# EAGLE design wireless breakout (EAGLE 6.5.0)
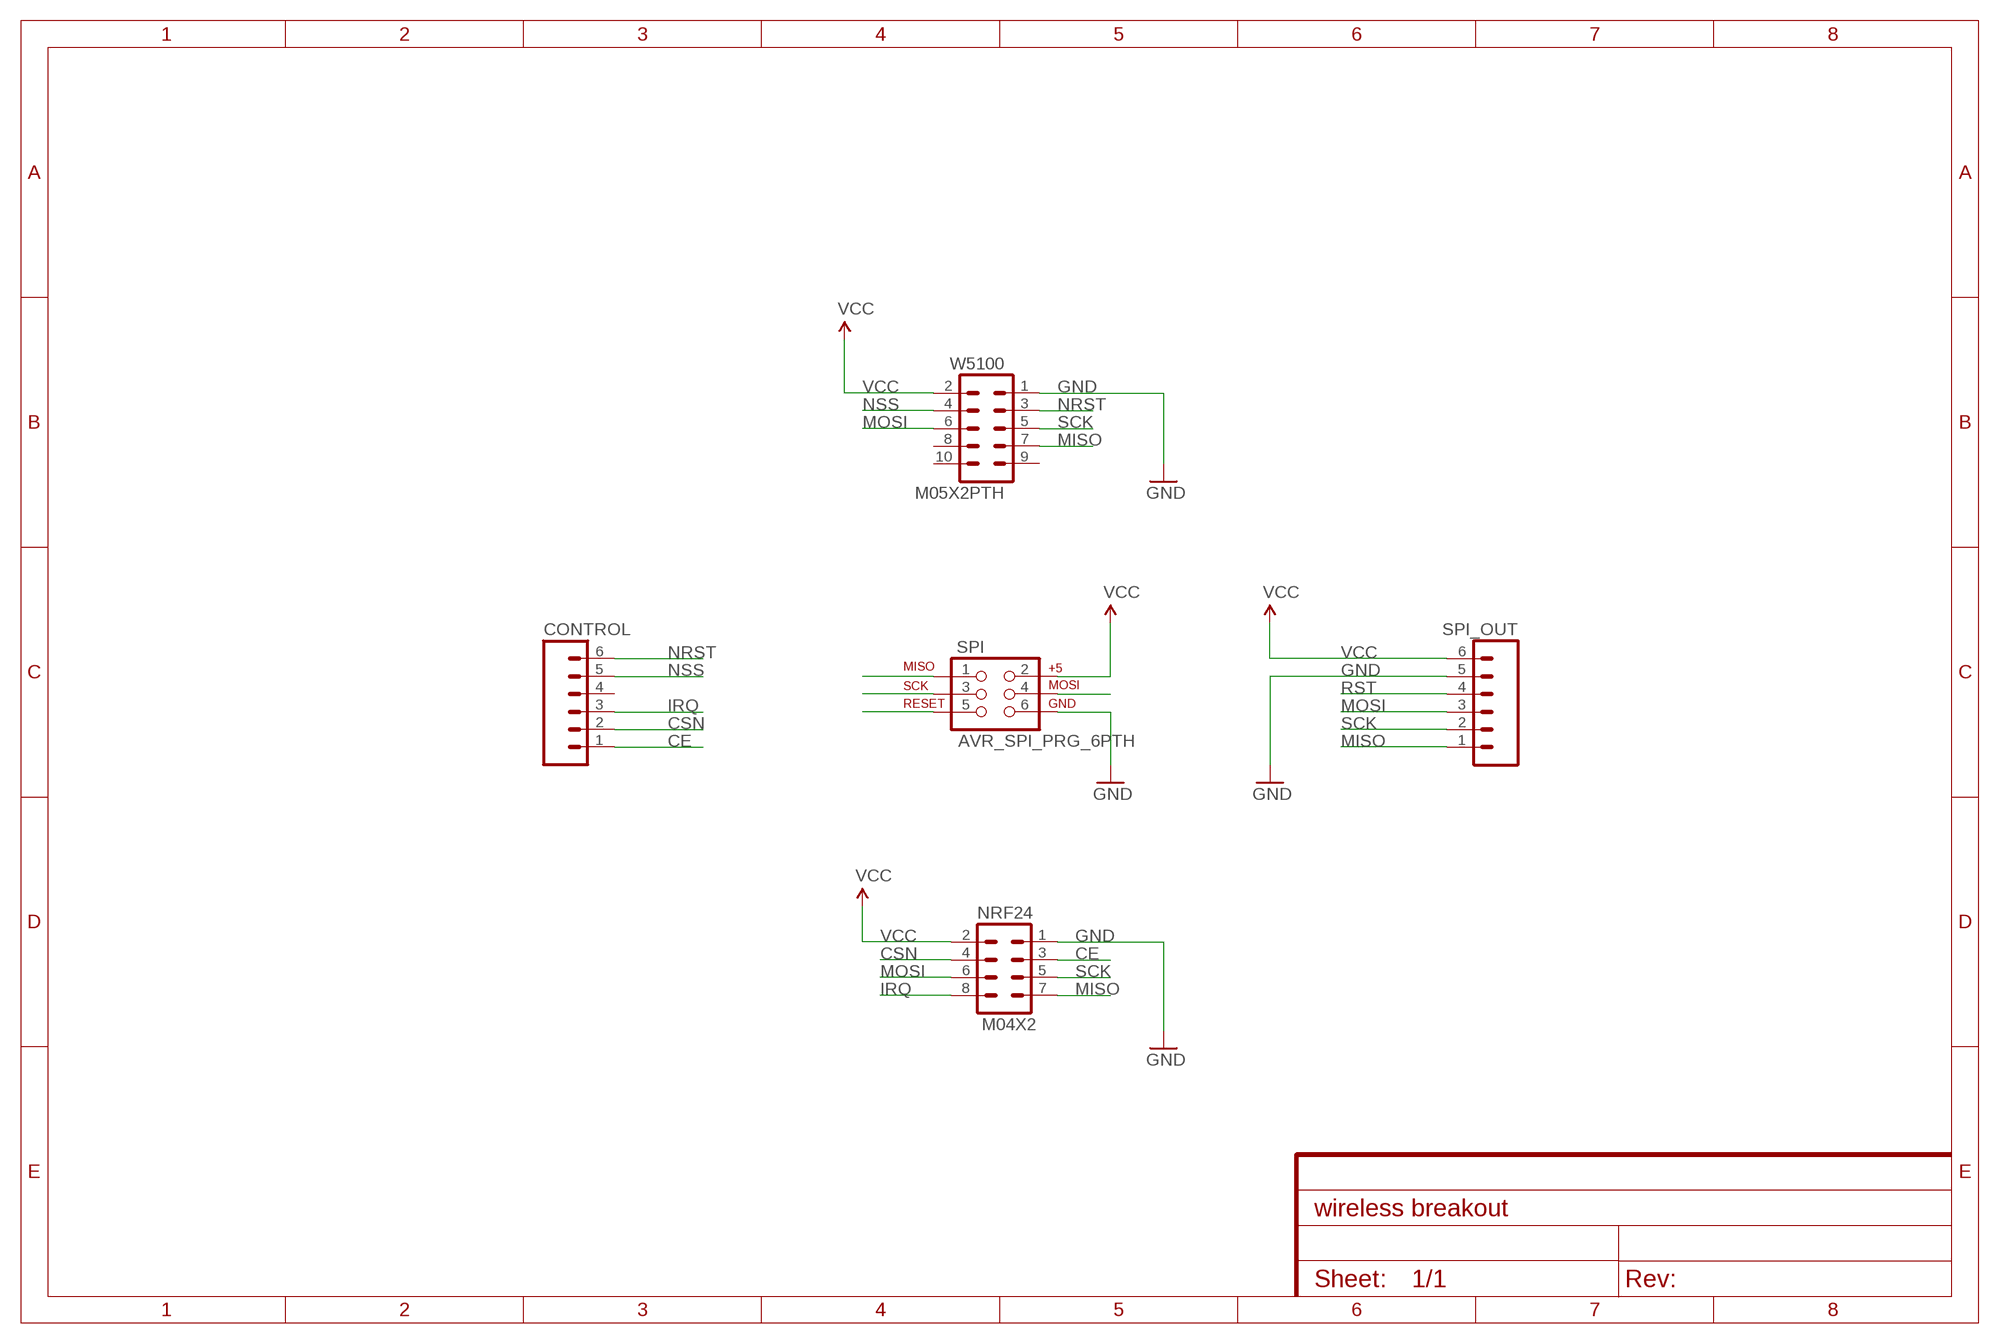
[diagram p0: schematic, sheet 1]

## Parts
CONTROL  M06LOCK  [1X06_LOCK]
NRF24  M04X2  [2X4]
SPI  AVR_SPI_PRG_6PTH  [2X3]
SPI_OUT  M06LOCK  [1X06_LOCK]
W5100  M05X2PTH  [AVR_ICSP]

## Nets
CE: CONTROL.1 NRF24.3
CSN: CONTROL.2 NRF24.4
GND: NRF24.1 SPI.6 SPI_OUT.5 W5100.1
IRQ: CONTROL.3 NRF24.8
MISO: NRF24.7 SPI.1 SPI_OUT.1 W5100.7
MOSI: NRF24.6 SPI.4 SPI_OUT.3 W5100.6
NRST: CONTROL.6 W5100.3
NSS: CONTROL.5 W5100.4
RST: SPI.5 SPI_OUT.4
SCK: NRF24.5 SPI.3 SPI_OUT.2 W5100.5
VCC: NRF24.2 SPI.2 SPI_OUT.6 W5100.2
Unconnected: CONTROL.4 W5100.8 W5100.9 W5100.10

## Library data of the parts
CONTROL SPI_OUT = SparkFun-Connectors:M06: Header 6 Standard 6-pin 0.1" header. Use with straight break away headers (SKU : PRT-00116), right angle break away headers (PRT-00553), swiss pins (PRT-00743), machine pins (PRT-00117), and female headers (PRT-00115). Molex polarized connector foot print use with SKU : PRT-08094 with associated crimp pins and housings. NOTES ON THE VARIANTS LOCK and LOCK_LONGPADS... This footprint was designed to help hold the alignment of a through-hole component (i.e. 6-pin header) while soldering it into place. You may notice that each hole has been shifted either up or down by 0.005 of an inch from it's more standard position (which is a perfectly straight line). This slight alteration caused the pins (the squares in the middle) to touch the edges of the holes. Because they are alternating, it causes a "brace" to hold the component in place. 0.005 has proven to be the perfect amount of "off-center" position when using our standard breakaway headers. Although looks a little odd when you look at the bare footprint, once you have a header in there, the alteration is very hard to notice. Also,if you push a header all the way into place, it is covered up entirely on the bottom side. This idea of altering the position of holes to aid alignment will be further integrated into the Sparkfun Library for other footprints. It can help hold any component with 3 or more connection pins.
NRF24 = SparkFun-Connectors:M04X2: .1" header, two rows of four.
SPI = SparkFun-Connectors:AVR_SPI_PRG_6: AVR ISP 6 Pin This is the reduced ISP connector for AVR programming. Common on Arduino. This footprint will take up less PCB space and can be used with a 10-pin to 6-pin adapter such as SKU: BOB-08508
W5100 = SparkFun-Connectors:M05X2: Header 5x2 Standard 10-pin dual row 0.1" header. Commonly used with AVR-ISP. Use with Spark Fun Electronics SKU: PRT-00778

## Board
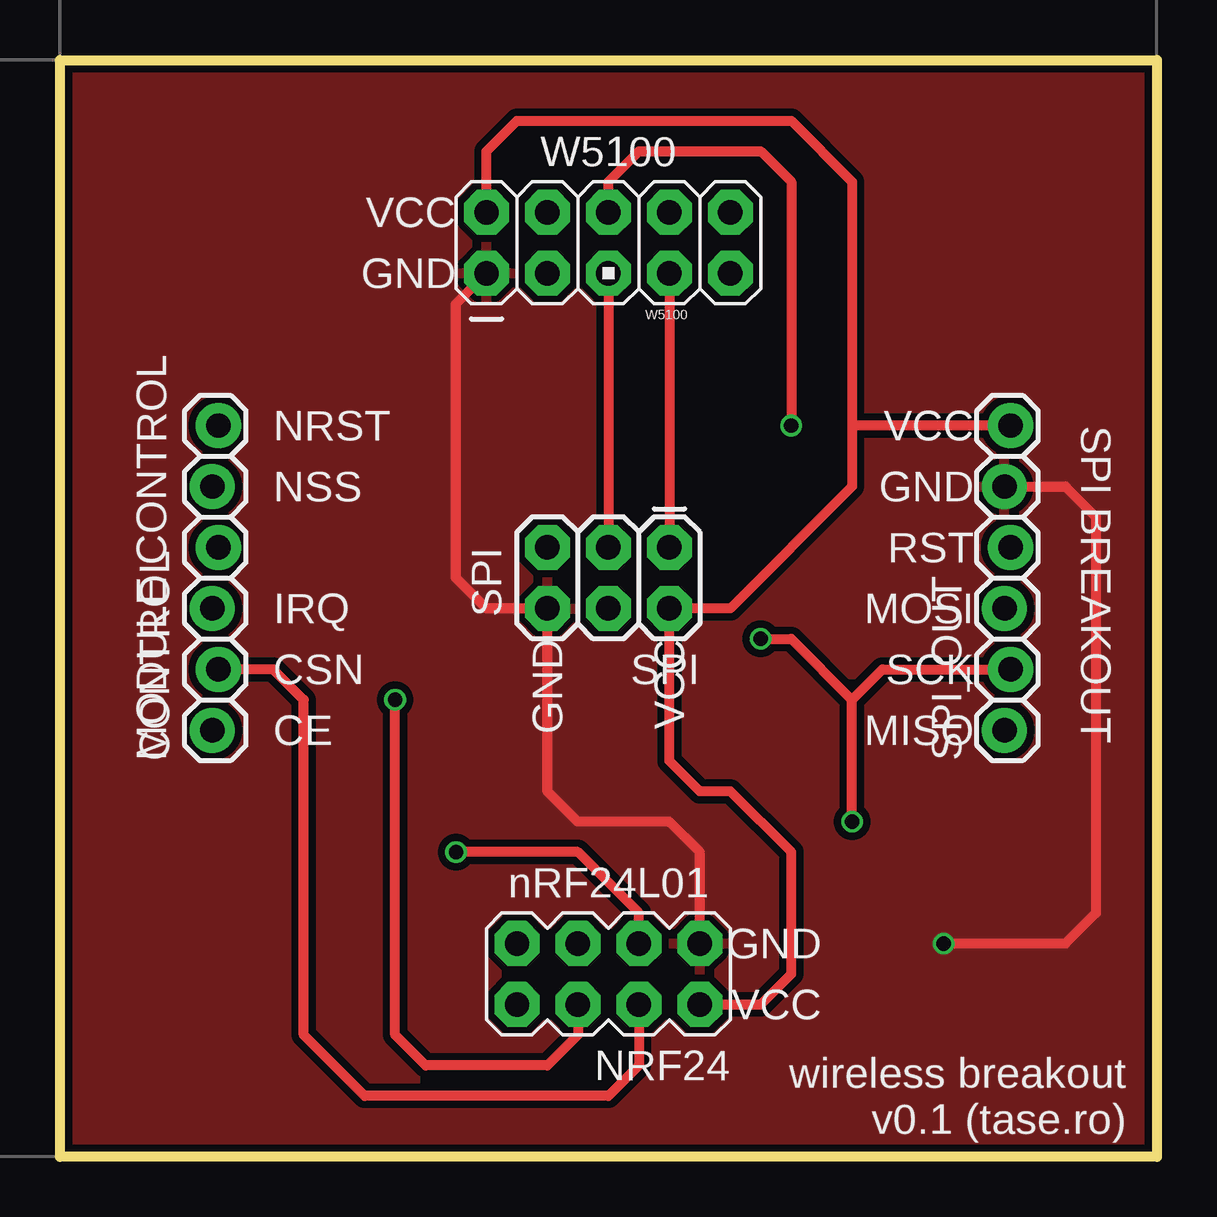
[diagram p1: board, top side]
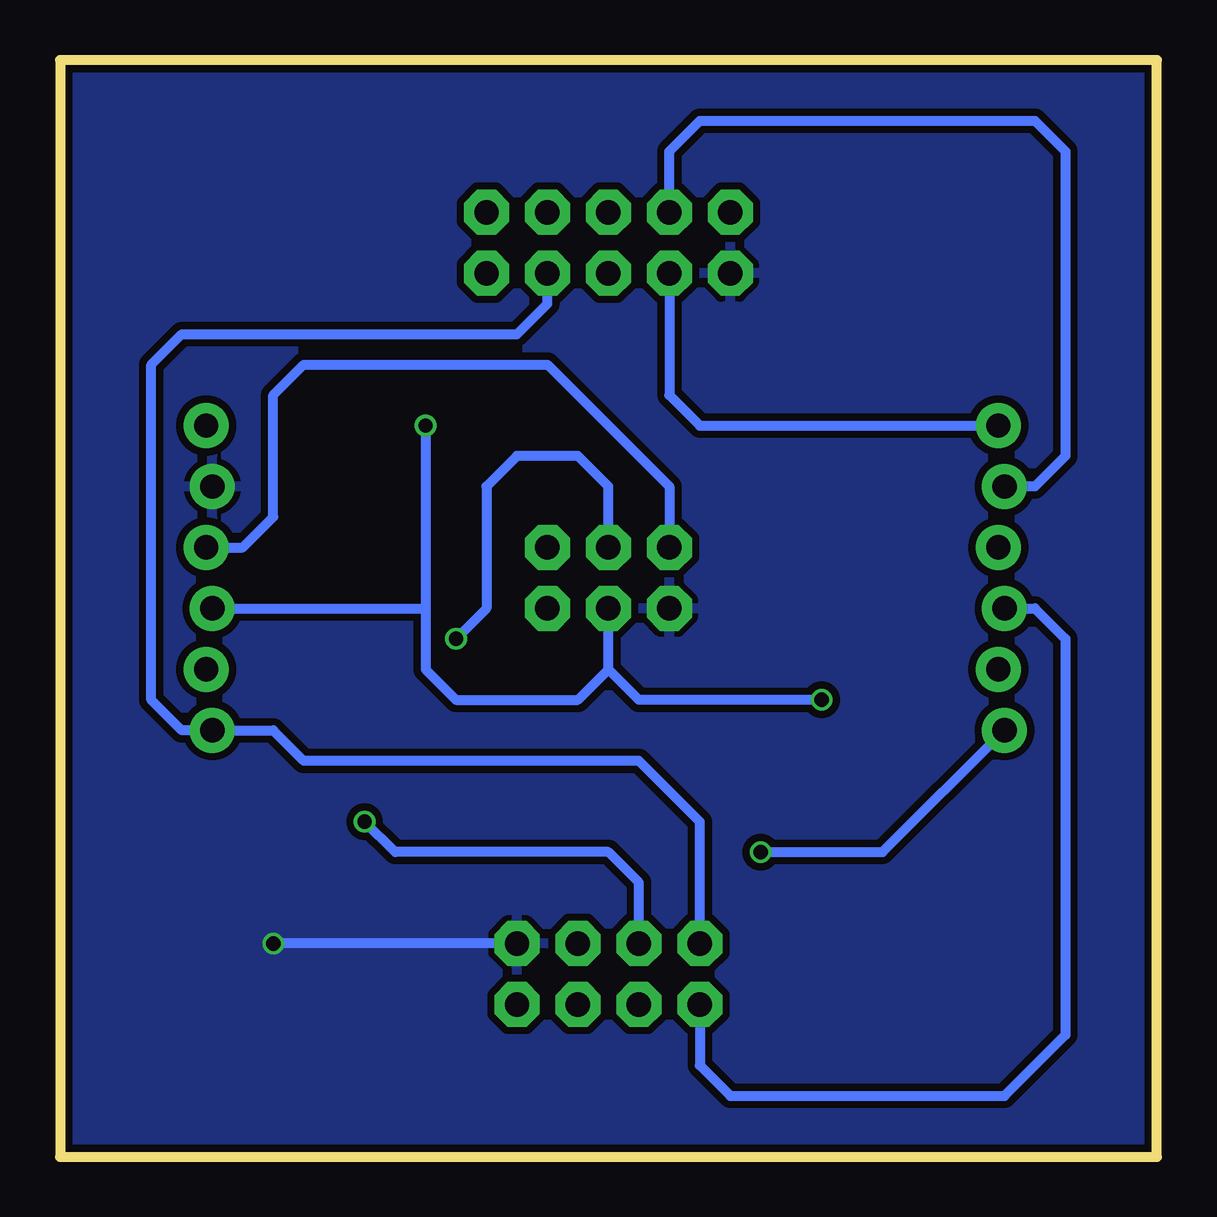
[diagram p2: board, bottom side, seen from below]

Size 45.72 x 45.72 mm. Coordinates in mm from the lower left corner, seen from the top.
Outline: 0,0 0,45.72 45.72,45.72 45.72,0 0,0
Copper layers (1*16): Top 0.035mm / dielectric 1.5mm / Bottom 0.035mm
Design rules "ITEADstudio_DRC": minimum track width 6mil, minimum drill 12mil, track to track 6mil, track to pad 6mil, pad to pad 6mil, via to via 6mil, smd to smd 0mil, copper to edge 10mil, drill to drill 10mil, minimum pad ring 10mil, minimum via ring 6mil, stop-mask expansion 2mil, vias tented up to drill 100mil, thermal gap 10mil

### Footprints (pad centres in the part's own frame; a part is rotated, then mirrored left to right if it is on the bottom)
1X06_LOCK = drill 1.016 pad 1.88: 1 0,0; 2 2.54,-0.254; 3 5.08,0; 4 7.62,-0.254; 5 10.16,0; 6 12.7,-0.254
2X4 = drill 1.016 pad 1.88 octagon: 1 -3.81,-1.27; 2 -3.81,1.27; 3 -1.27,-1.27; 4 -1.27,1.27; 5 1.27,-1.27; 6 1.27,1.27; 7 3.81,-1.27; 8 3.81,1.27
2X3 = drill 1.016 pad 1.88 octagon: 1 0,0; 2 0,2.54; 3 2.54,0; 4 2.54,2.54; 5 5.08,0; 6 5.08,2.54
AVR_ICSP = drill 1.016 pad 1.88 octagon: 1 -1.27,5.08; 2 1.27,5.08; 3 -1.27,2.54; 4 1.27,2.54; 5 -1.27,0; 6 1.27,0; 7 -1.27,-2.54; 8 1.27,-2.54; 9 -1.27,-5.08; 10 1.27,-5.08

### Placement (x,y rotation side)
CONTROL  6.35,17.78 90 top
NRF24  22.86,7.62 180 top
SPI  25.4,25.4 180 top
SPI_OUT  39.37,17.78 90 top
W5100  22.86,38.1 90 top

### Tracks (layer width: path | path; a pad name or v marks a point on that pad's centre or on a via)
CE  (via drill 0.6)
  Top 0.406: NRF24.3 24.13,10.16 21.59,12.7 v16.51,12.7
  Bottom 0.406: v16.51,12.7 11.43,12.7 CONTROL.1
CSN
  Top 0.406: NRF24.4 24.13,3.81 22.86,2.54 12.7,2.54 10.16,5.08 10.16,19.05 8.89,20.32 CONTROL.2
GND  (via drill 0.6)
  Top 0.406: W5100.1 16.51,35.56 16.51,24.13 17.78,22.86 SPI.6 20.32,15.24 21.59,13.97 25.4,13.97 26.67,12.7 NRF24.1 | SPI_OUT.5 41.91,27.94 43.18,26.67 43.18,10.16 41.91,8.89 v36.83,8.89
  Bottom 0.406: NRF24.1 v36.83,8.89
  pour Top (isolate 0.305): 0,0 0,45.72 45.72,45.72 45.72,0
  pour Bottom (isolate 0.305): 0,0 0,45.72 45.72,45.72 45.72,0
IRQ
  Bottom 0.406: CONTROL.3 5.08,22.86 3.81,21.59 3.81,5.08 6.35,2.54 17.78,2.54 19.05,3.81 NRF24.8
MISO
  Top 0.406: W5100.7 SPI.1
  Bottom 0.406: W5100.7 25.4,35.56 26.67,34.29 40.64,34.29 41.91,33.02 41.91,19.05 40.64,17.78 SPI_OUT.1 36.83,17.78 35.56,16.51 21.59,16.51 19.05,13.97 NRF24.7
MOSI  (via drill 0.6)
  Top 0.406: W5100.6 22.86,40.64 24.13,41.91 29.21,41.91 30.48,40.64 v30.48,30.48 | NRF24.6 21.59,5.08 20.32,3.81 15.24,3.81 13.97,5.08 v13.97,19.05
  Bottom 0.406: v30.48,30.48 30.48,22.86 | 30.48,22.86 30.48,20.32 29.21,19.05 24.13,19.05 22.86,20.32 | 22.86,20.32 SPI.4 | SPI_OUT.3 30.48,22.86 | v13.97,19.05 21.59,19.05 22.86,20.32
NRST
  Bottom 0.406: W5100.3 20.32,31.75 19.05,30.48 CONTROL.6
NSS
  Bottom 0.406: W5100.4 20.32,41.91 19.05,43.18 5.08,43.18 3.81,41.91 3.81,29.21 5.08,27.94 CONTROL.5
RST
  Bottom 0.406: SPI_OUT.4 38.1,25.4 36.83,26.67 36.83,31.75 35.56,33.02 25.4,33.02 20.32,27.94 SPI.5
SCK  (via drill 0.6)
  Top 0.406: W5100.5 SPI.3 | 33.02,19.05 34.29,20.32 SPI_OUT.2 | v29.21,21.59 30.48,21.59 33.02,19.05 | v33.02,13.97 33.02,19.05
  Bottom 0.406: SPI.3 22.86,27.94 24.13,29.21 26.67,29.21 27.94,27.94 27.94,22.86 v29.21,21.59 | NRF24.5 21.59,11.43 22.86,12.7 31.75,12.7 v33.02,13.97
VCC
  Top 0.406: W5100.2 17.78,41.91 19.05,43.18 30.48,43.18 33.02,40.64 33.02,30.48 | 33.02,30.48 33.02,27.94 27.94,22.86 SPI.2 25.4,16.51 26.67,15.24 27.94,15.24 30.48,12.7 30.48,7.62 29.21,6.35 NRF24.2 | SPI_OUT.6 33.02,30.48

### Text on the board
tPlace: W5100 | VCC | GND | NRST | VCC | SPI BREAKOUT | NSS | GND | SPI | RST | IRQ | MOSI | GND | VCC | CSN | SCK | CE | MISO | MODULE CONTROL | nRF24L01 | GND | VCC | wireless breakout / v0.1 (tase.ro)